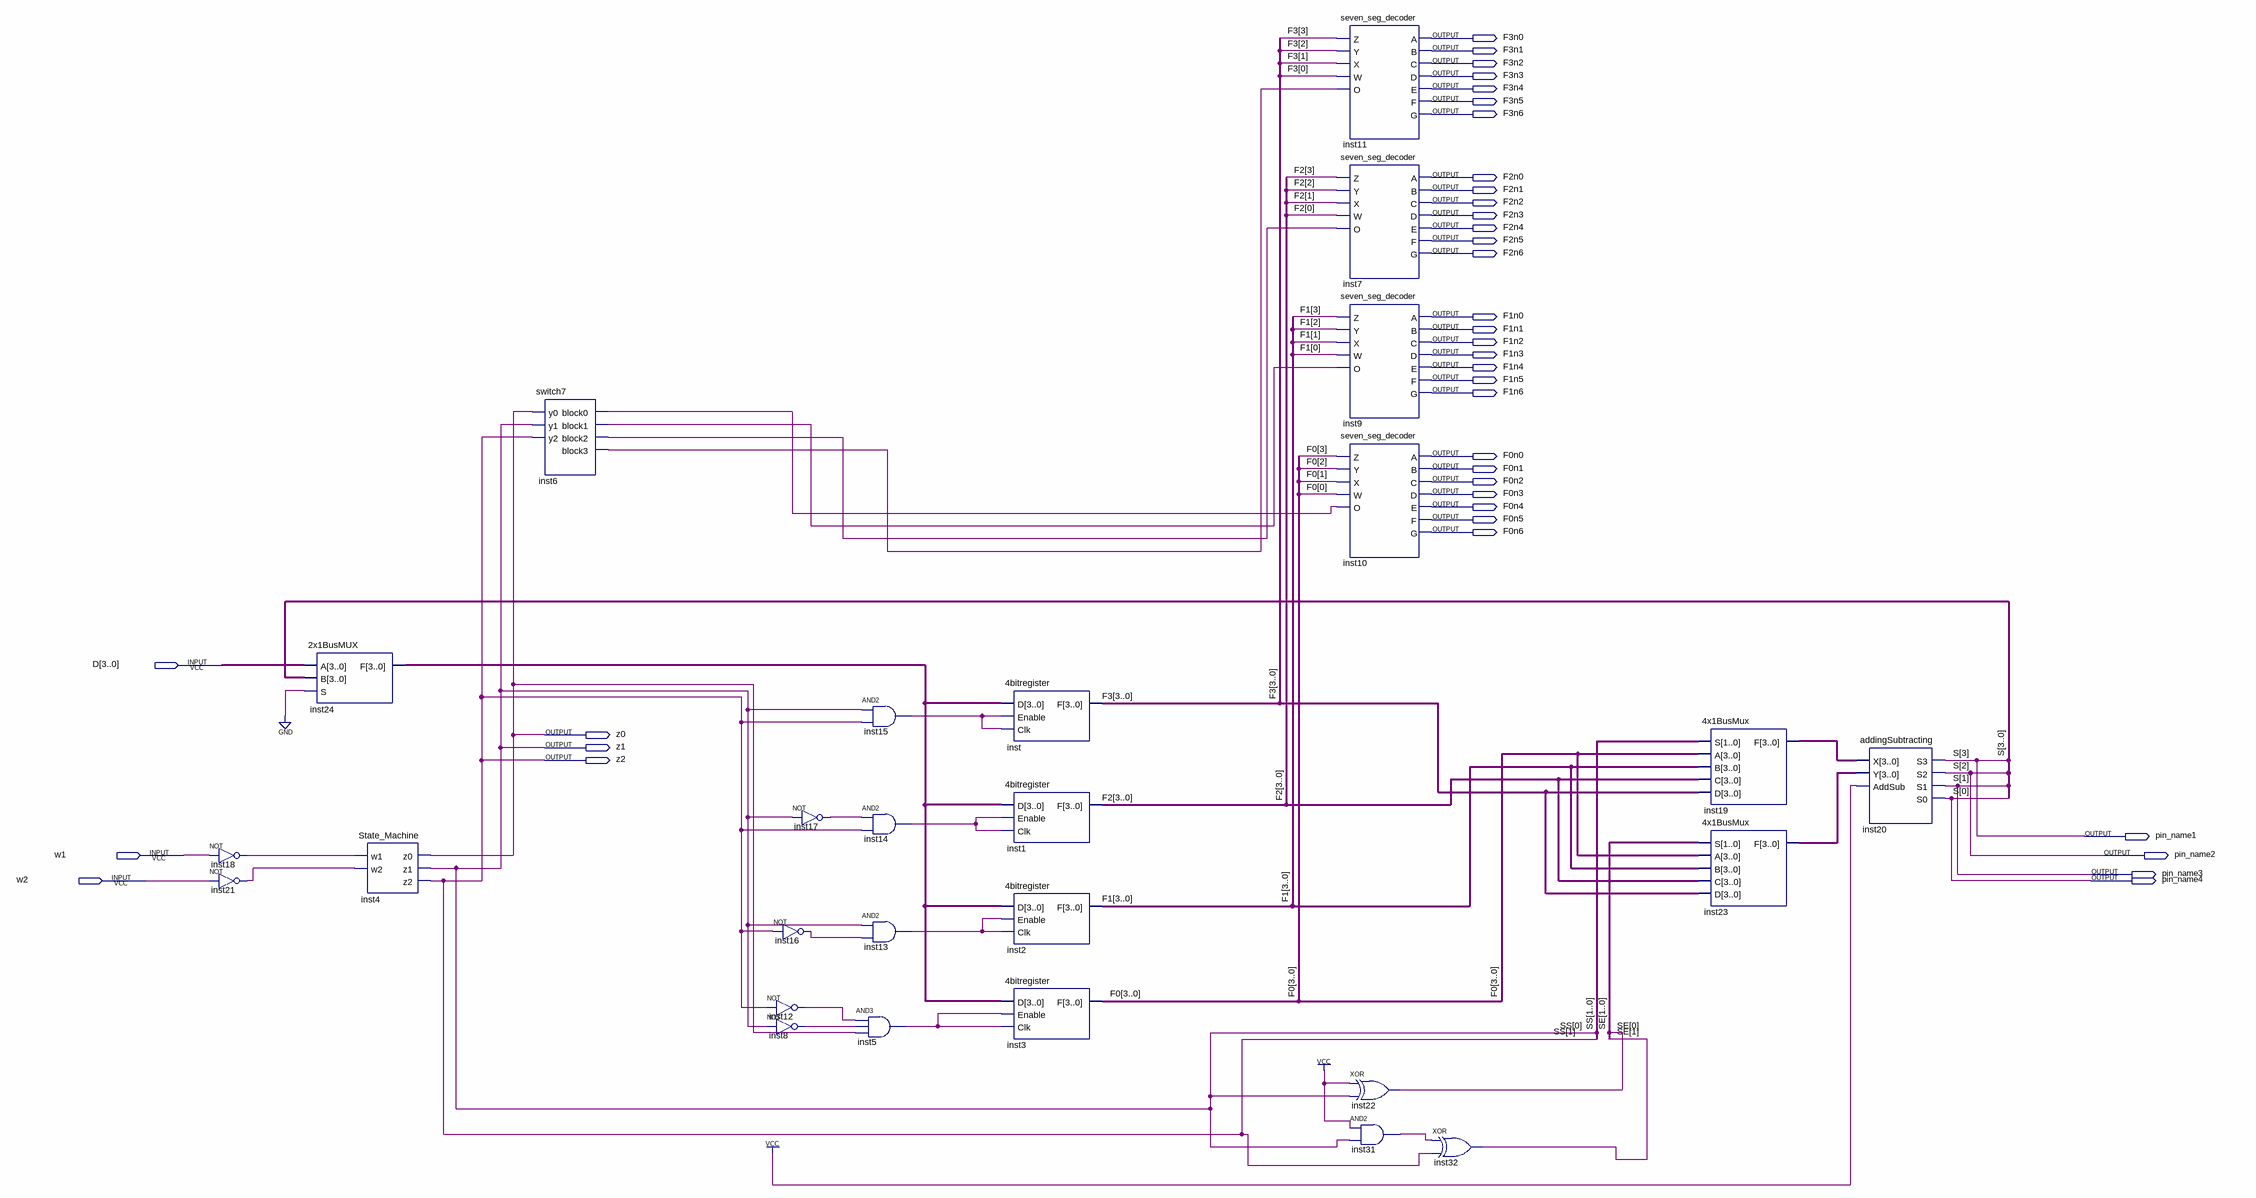
[diagram p0: schematic sheet]
// Quartus schematic newthings.bdf as structural Verilog: 27 symbols, 38 pins
module newthings (
  input  [3:0] D,
  input  w1,
  input  w2,
  output F3n0,
  output F3n1,
  output F3n2,
  output F3n3,
  output F3n4,
  output F3n5,
  output F3n6,
  output F2n0,
  output F2n1,
  output F2n2,
  output F2n3,
  output F2n4,
  output F2n5,
  output F2n6,
  output F1n0,
  output F1n1,
  output F1n2,
  output F1n3,
  output F1n4,
  output F1n5,
  output F1n6,
  output F0n0,
  output F0n1,
  output F0n2,
  output F0n3,
  output F0n4,
  output F0n5,
  output F0n6,
  output z0,
  output z1,
  output z2,
  output pin_name1,
  output pin_name2,
  output pin_name3,
  output pin_name4
);

  wire inst5_out, inst6_block0, inst6_block1, inst6_block2, inst6_block3, inst8_out, inst12_out, inst13_out,
       inst14_out, inst15_out, inst16_out, inst17_out, inst18_out, inst21_out, inst31_out;
  wire [1:0] SE;
  wire [3:0] F0, F1, F2, F3, inst19_f, inst23_f, inst24_f;

  not inst18 (inst18_out, w1);
  not inst21 (inst21_out, w2);
  \2x1BusMUX  inst24 (.A(D), .B({pin_name1, pin_name2, pin_name3, pin_name4}), .S(1'b0), .F(inst24_f));
  State_Machine inst4 (.w1(inst18_out), .w2(inst21_out), .z0(z0), .z1(z1), .z2(z2));
  switch7 inst6 (
    .y0(z0), .y1(z1), .y2(z2), .block0(inst6_block0), .block1(inst6_block1), .block2(inst6_block2),
    .block3(inst6_block3));
  not inst17 (inst17_out, z1);
  not inst16 (inst16_out, z2);
  not inst12 (inst12_out, z2);
  not inst8 (inst8_out, z1);
  and inst15 (inst15_out, z1, z2);
  and inst14 (inst14_out, inst17_out, z2);
  and inst13 (inst13_out, z1, inst16_out);
  and inst5 (inst5_out, inst12_out, inst8_out, z0);
  \4bitregister  inst (.D(inst24_f), .Enable(inst15_out), .Clk(inst15_out), .F(F3));
  \4bitregister  inst1 (.D(inst24_f), .Enable(inst14_out), .Clk(inst14_out), .F(F2));
  \4bitregister  inst2 (.D(inst24_f), .Enable(inst13_out), .Clk(inst13_out), .F(F1));
  \4bitregister  inst3 (.D(inst24_f), .Enable(inst5_out), .Clk(inst5_out), .F(F0));
  seven_seg_decoder inst11 (
    .Z(F3[3]), .Y(F3[2]), .X(F3[1]), .W(F3[0]), .O(inst6_block3), .A(F3n0), .B(F3n1), .C(F3n2), .D(F3n3),
    .E(F3n4), .F(F3n5), .G(F3n6));
  seven_seg_decoder inst7 (
    .Z(F2[3]), .Y(F2[2]), .X(F2[1]), .W(F2[0]), .O(inst6_block2), .A(F2n0), .B(F2n1), .C(F2n2), .D(F2n3),
    .E(F2n4), .F(F2n5), .G(F2n6));
  seven_seg_decoder inst9 (
    .Z(F1[3]), .Y(F1[2]), .X(F1[1]), .W(F1[0]), .O(inst6_block1), .A(F1n0), .B(F1n1), .C(F1n2), .D(F1n3),
    .E(F1n4), .F(F1n5), .G(F1n6));
  seven_seg_decoder inst10 (
    .Z(F0[3]), .Y(F0[2]), .X(F0[1]), .W(F0[0]), .O(inst6_block0), .A(F0n0), .B(F0n1), .C(F0n2), .D(F0n3),
    .E(F0n4), .F(F0n5), .G(F0n6));
  xor inst22 (SE[0], 1'b1, z1);
  and inst31 (inst31_out, 1'b1, z1);
  xor inst32 (SE[1], inst31_out, z2);
  \4x1BusMux  inst19 (.S({z2, z1}), .A(F0), .B(F1), .C(F2), .D(F3), .F(inst19_f));
  \4x1BusMux  inst23 (.S(SE), .A(F0), .B(F1), .C(F2), .D(F3), .F(inst23_f));
  addingSubtracting inst20 (
    .X(inst19_f), .Y(inst23_f), .AddSub(1'b1), .S3(pin_name1), .S2(pin_name2), .S1(pin_name3), .S0(pin_name4));

  // Other names for the same wires on the sheet: S[3:0] = {pin_name1, pin_name2, pin_name3, pin_name4};
  //   SS[1:0] = {z2, z1}
endmodule
